# EAGLE design simple_board (EAGLE 9.2.2)
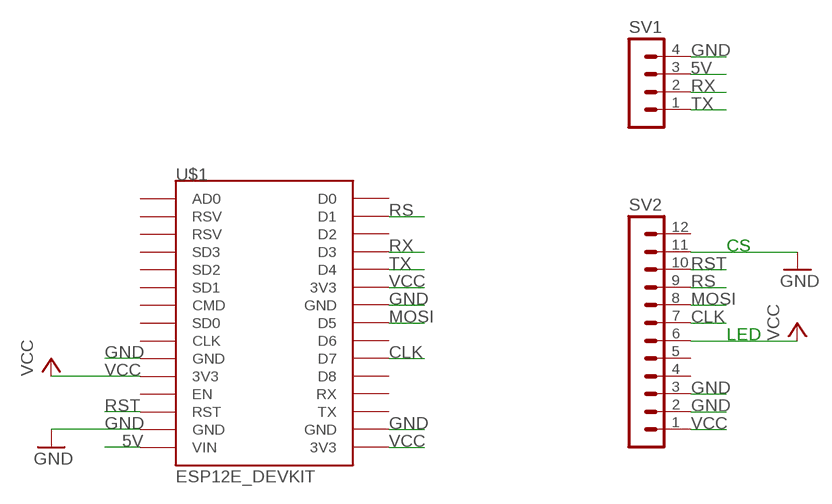
[diagram p0: schematic, sheet 1]

## Parts
SV1  MA04-1  [MA04-1]
SV2  MA12-1  [MA12-1]
U$1  ESP12E_DEVKIT  [ESP12E_DEVKIT]

## Nets
5V: SV1.3 U$1.VIN
CLK: SV2.7 U$1.D7
GND: SV1.4 SV2.2 SV2.3 SV2.11 U$1.GND@0(GND) U$1.GND@1(GND) U$1.GND@2(GND) U$1.GND@3(GND)
MOSI: SV2.8 U$1.D5
RS: SV2.9 U$1.D1
RST: SV2.10 U$1.RST
RX: SV1.2 U$1.D3
TX: SV1.1 U$1.D4
VCC: SV2.1 SV2.6 U$1.3V3@0(3V3) U$1.3V3@1(3V3) U$1.3V3@2(3V3)
Unconnected: SV2.4 SV2.5 SV2.12 U$1.AD0 U$1.CLK U$1.CMD U$1.D0 U$1.D2 U$1.D6 U$1.D8 U$1.EN U$1.RSV@0(RSV) U$1.RSV@1(RSV) U$1.RX U$1.SD0 U$1.SD1 U$1.SD2 U$1.SD3 U$1.TX

## Notes on the sheet
- CS
- LED

## Library data of the parts
SV1 = con-lstb:MA04-1: PIN HEADER; OC_FARNELL: unknown; OC_NEWARK: unknown
SV2 = con-lstb:MA12-1: PIN HEADER; OC_FARNELL: unknown; OC_NEWARK: unknown
U$1 = ESP12E_DEVKIT:ESP12E_DEVKIT: ESP12E DEVKIT BOARD

## Board
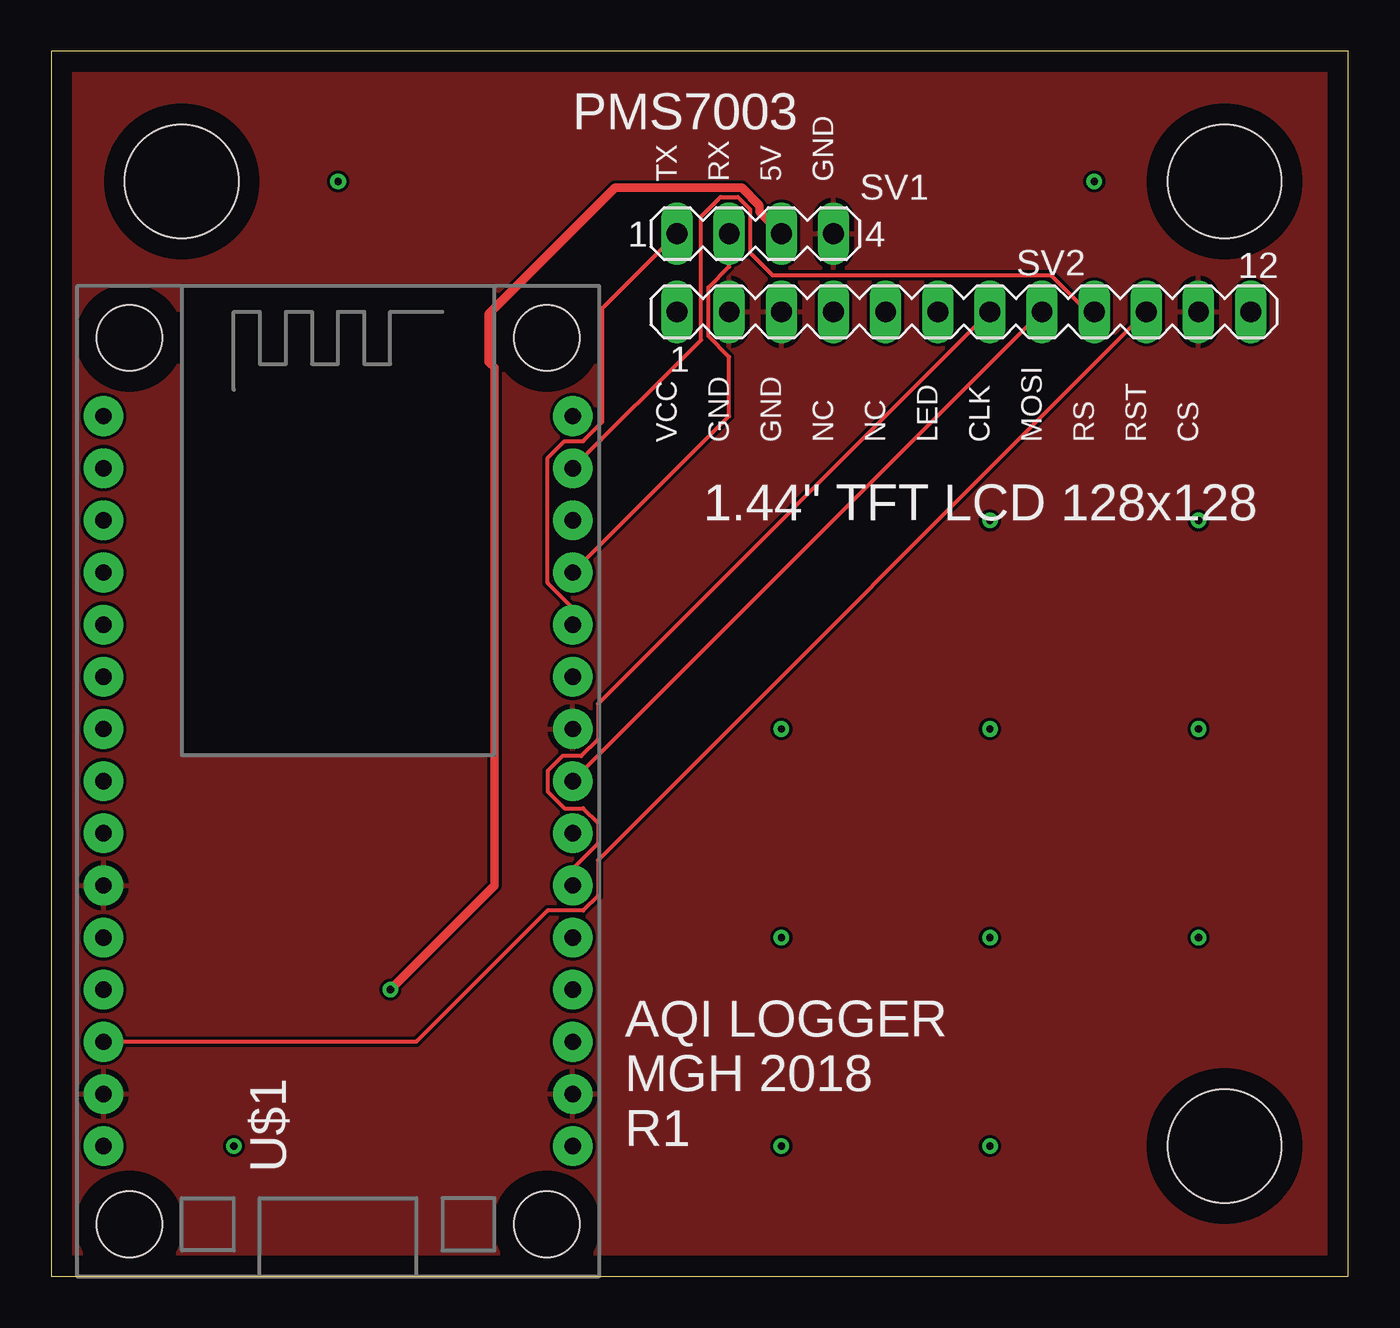
[diagram p1: board, top side]
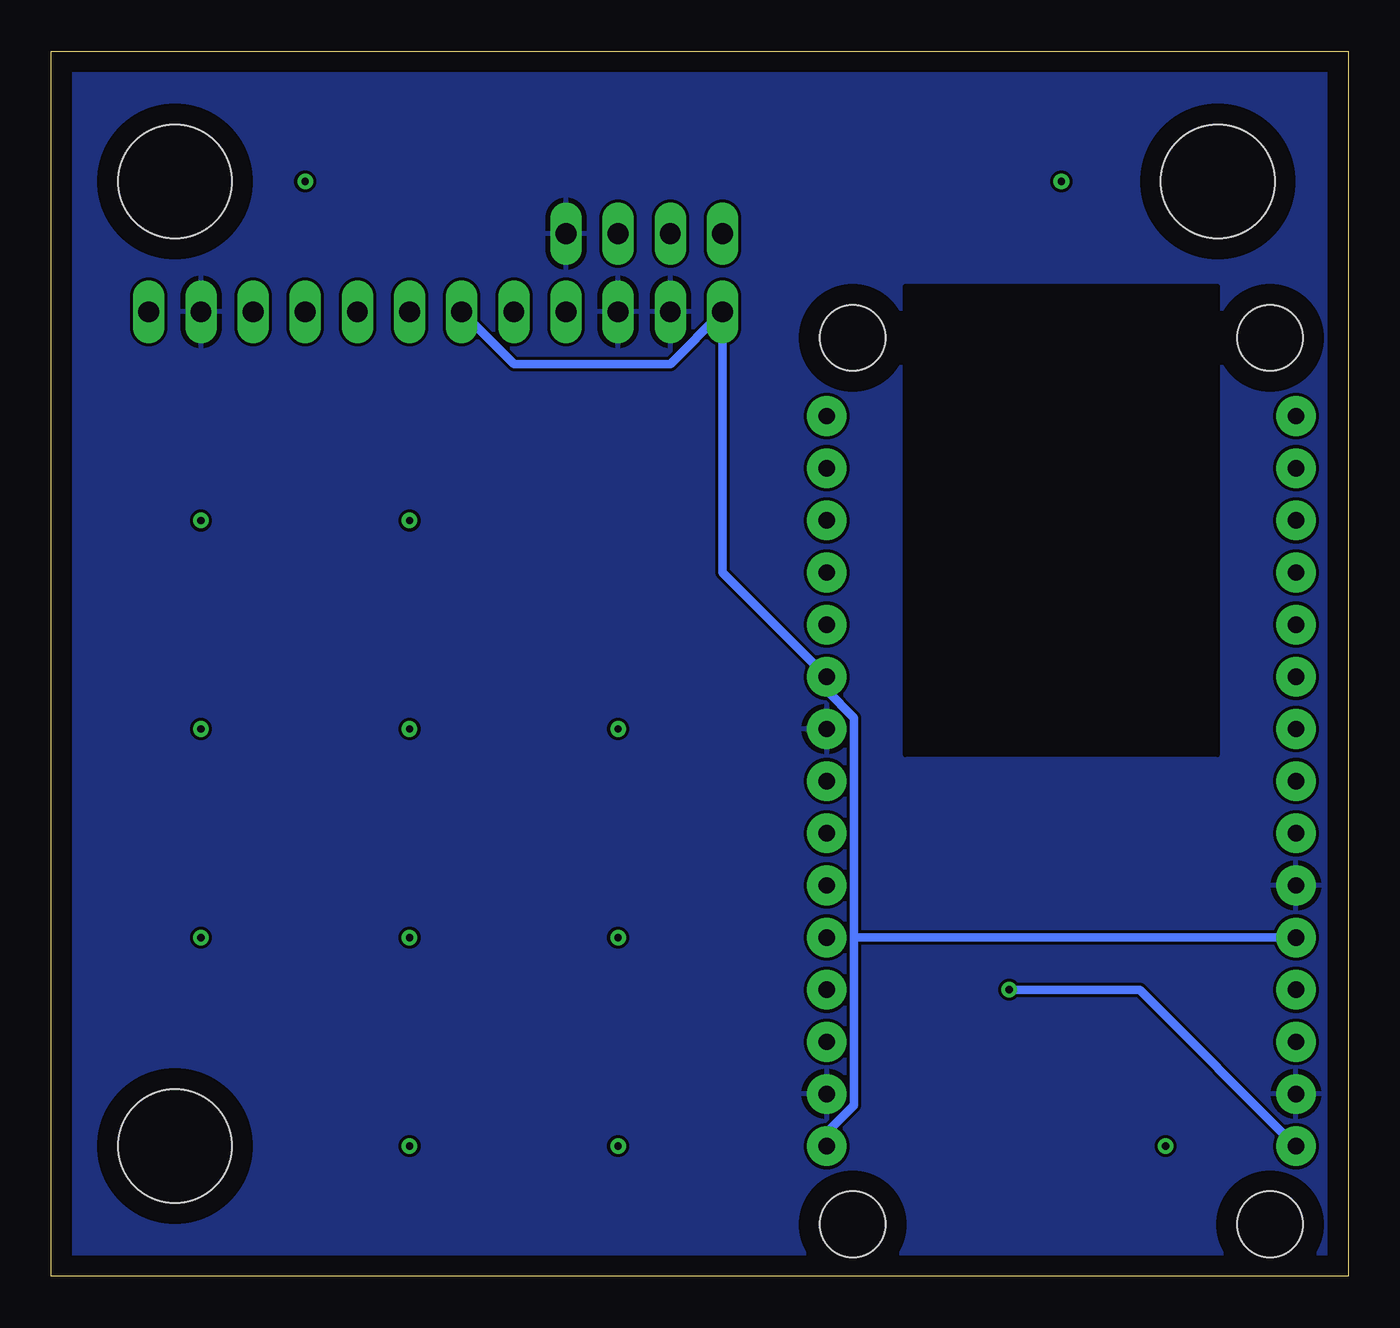
[diagram p2: board, bottom side, seen from below]

Size 63.17 x 59.68 mm. Coordinates in mm from the lower left corner, seen from the top.
Outline: 0,0 63.17,0 63.17,59.68 0,59.68 0,0
Copper layers (1*16): Top 0.035mm / dielectric 1.5mm / Bottom 0.035mm
Design rules "default": minimum track width 6mil, minimum drill 0.35mm, track to track 6mil, track to pad 6mil, pad to pad 6mil, via to via 6mil, smd to smd 6mil, copper to edge 40mil, drill to drill 6mil, minimum pad ring 10mil, minimum via ring 8mil, stop-mask expansion 4mil, vias tented up to drill 0mil, thermal gap 10mil
Holes 5.54 mm at 6.35,53.34 57.15,6.35 57.15,53.34

### Footprints (pad centres in the part's own frame; a part is rotated, then mirrored left to right if it is on the bottom)
MA04-1 = drill 1.016 long: 1 -3.81,0; 2 -1.27,0; 3 1.27,0; 4 3.81,0
MA12-1 = drill 1.016 long: 1 -13.97,0; 2 -11.43,0; 3 -8.89,0; 4 -6.35,0; 5 -3.81,0; 6 -1.27,0; 7 1.27,0; 8 3.81,0; 9 6.35,0; 10 8.89,0; 11 11.43,0; 12 13.97,0
ESP12E_DEVKIT = drill 0.8 pad 1.93: 3V3@0 -11.43,-7.62; 3V3@1 11.43,5.08; 3V3@2 11.43,-17.78; AD0 -11.43,17.78; CLK -11.43,-2.54; CMD -11.43,2.54; D0 11.43,17.78; D1 11.43,15.24; D2 11.43,12.7; D3 11.43,10.16; D4 11.43,7.62; D5 11.43,0; D6 11.43,-2.54; D7 11.43,-5.08; D8 11.43,-7.62; EN -11.43,-10.16; GND@0 -11.43,-5.08; GND@1 -11.43,-15.24; GND@2 11.43,2.54; GND@3 11.43,-15.24; RST -11.43,-12.7; RSV@0 -11.43,15.24; RSV@1 -11.43,12.7; RX 11.43,-10.16; SD0 -11.43,0; SD1 -11.43,5.08; SD2 -11.43,7.62; SD3 -11.43,10.16; TX 11.43,-12.7; VIN -11.43,-17.78 | hole 3.2: -10.16,21.59; 10.16,21.59; 10.16,-21.59; -10.16,-21.59

### Placement (x,y rotation side)
SV1  34.29,50.8 0 top
SV2  44.45,46.99 0 top
U$1  13.97,24.13 0 top

### Tracks (layer width: path | path; a pad name or v marks a point on that pad's centre or on a via)
5V  (via drill 0.35)
  Top 0.406: SV1.3 34.49,51.87 34.49,52.17 33.63,53.03 27.46,53.03 21.31,46.89 21.31,44.55 21.59,44.27 21.59,19.05 v16.51,13.97
  Bottom 0.406: v16.51,13.97 10.16,13.97 U$1.VIN
CLK
  Top 0.203: SV2.7 26.62,27.89 26.62,26.16 25.8,25.35 24.89,25.35 24.18,24.64 24.18,23.62 25,22.81 25.91,22.81 26.62,22.09 26.62,21.09 25.4,19.87 U$1.D7
CUTOUT
  cutout Top: 6.35,48.26 6.35,25.4 21.59,25.4 21.59,48.26
  cutout Bottom: 6.35,48.26 6.35,25.4 21.59,25.4 21.59,48.26
GND
  pour Top: -1.27,60.96 63.5,60.96 63.5,-1.27 -1.27,-1.27
  pour Bottom: -2.54,62.23 64.77,62.23 64.77,-2.54 -2.54,-2.54
MOSI
  Top 0.203: SV2.8 U$1.D5
N$1  (via drill 0.35)
  other vias: 13.97,53.34
N$2  (via drill 0.35)
  other vias: 50.8,53.34
N$4  (via drill 0.35)
  other vias: 8.89,6.35
N$6  (via drill 0.35)
  other vias: 35.56,6.35
N$7  (via drill 0.35)
  other vias: 35.56,16.51
N$8  (via drill 0.35)
  other vias: 45.72,16.51
N$9  (via drill 0.35)
  other vias: 45.72,6.35
N$10  (via drill 0.35)
  other vias: 55.88,16.51
N$11  (via drill 0.35)
  other vias: 55.88,26.67
N$12  (via drill 0.35)
  other vias: 45.72,26.67
N$13  (via drill 0.35)
  other vias: 35.56,26.67
N$14  (via drill 0.35)
  other vias: 55.88,36.83
N$15  (via drill 0.35)
  other vias: 45.72,36.83
RS
  Top 0.203: U$1.D1 31.65,45.62 31.65,51.63 32.6,52.58 33.44,52.58 34.04,51.98 34.04,49.87 35.14,48.77 48.68,48.77 50.46,46.99 SV2.9
RST
  Top 0.203: U$1.RST 17.78,11.43 24.18,17.83 25.91,17.83 26.62,18.55 26.62,20.27 SV2.10
RX
  Top 0.203: U$1.D3 33.02,41.91 33.02,44.79 32,45.81 32,48.17 33.02,49.19 SV1.2
TX
  Top 0.203: U$1.D4 25.4,32.57 24.18,33.78 24.18,39.88 25,40.69 25.91,40.69 26.85,41.63 26.85,47.17 SV1.1
VCC
  Bottom 0.406: U$1.3V3@2 25.4,7.02 24.08,8.34 24.08,16.51 | 24.08,16.51 24.08,27.22 25.4,28.54 U$1.3V3@1 30.48,34.29 SV2.1 33.02,44.45 40.64,44.45 SV2.6 | U$1.3V3@0 24.08,16.51

### Text on the board
tNames: PMS7003 | TX | RX | 5V | GND | VCC | GND | GND | NC | NC | LED | CLK | MOSI | RS | RST | CS | 1.44" TFT LCD 128x128 | AQI LOGGER / MGH 2018 / R1